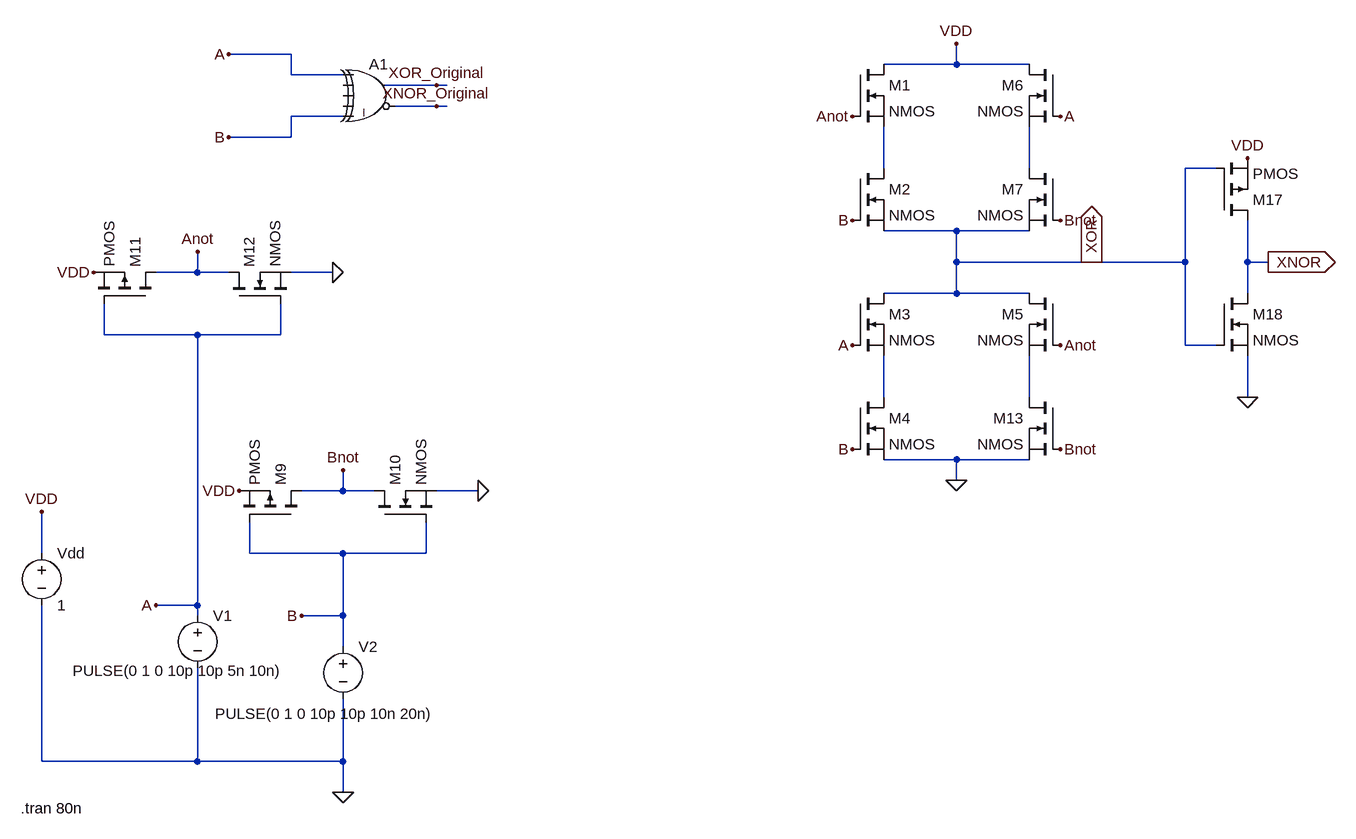
[diagram p0: schematic XOR_&_XNOR_2ip.asc]
XOR_&_XNOR_2ip.asc, the LTspice schematic file:
Version 4
SHEET 1 3108 680
WIRE 528 -656 432 -656
WIRE 1552 -640 1552 -672
WIRE 1552 -640 1440 -640
WIRE 1664 -640 1552 -640
WIRE 528 -624 528 -656
WIRE 608 -624 528 -624
WIRE 752 -608 672 -608
WIRE 768 -608 752 -608
WIRE 752 -576 688 -576
WIRE 768 -576 752 -576
WIRE 608 -560 528 -560
WIRE 528 -528 528 -560
WIRE 528 -528 432 -528
WIRE 1440 -480 1440 -544
WIRE 1664 -480 1664 -544
WIRE 1952 -480 1904 -480
WIRE 1552 -384 1440 -384
WIRE 1664 -384 1552 -384
WIRE 1552 -336 1552 -384
WIRE 1760 -336 1552 -336
WIRE 1904 -336 1904 -480
WIRE 1904 -336 1760 -336
WIRE 2000 -336 2000 -400
WIRE 2032 -336 2000 -336
WIRE 384 -320 384 -352
WIRE 384 -320 320 -320
WIRE 432 -320 384 -320
WIRE 592 -320 528 -320
WIRE 1552 -288 1552 -336
WIRE 1552 -288 1440 -288
WIRE 1664 -288 1552 -288
WIRE 2000 -288 2000 -336
WIRE 240 -224 240 -272
WIRE 384 -224 240 -224
WIRE 512 -224 512 -272
WIRE 512 -224 384 -224
WIRE 1904 -208 1904 -336
WIRE 1952 -208 1904 -208
WIRE 1440 -128 1440 -192
WIRE 1664 -128 1664 -192
WIRE 2000 -128 2000 -192
WIRE 1552 -32 1440 -32
WIRE 1664 -32 1552 -32
WIRE 1552 0 1552 -32
WIRE 608 16 608 -16
WIRE 608 16 544 16
WIRE 656 16 608 16
WIRE 816 16 752 16
WIRE 144 112 144 48
WIRE 464 112 464 64
WIRE 608 112 464 112
WIRE 736 112 736 64
WIRE 736 112 608 112
WIRE 384 192 384 -224
WIRE 384 192 320 192
WIRE 384 208 384 192
WIRE 608 208 608 112
WIRE 608 208 544 208
WIRE 608 256 608 208
WIRE 144 432 144 192
WIRE 384 432 384 288
WIRE 384 432 144 432
WIRE 608 432 608 336
WIRE 608 432 384 432
WIRE 608 480 608 432
FLAG 608 480 0
FLAG 320 192 A
FLAG 144 48 VDD
FLAG 448 16 VDD
FLAG 816 16 0
FLAG 224 -320 VDD
FLAG 592 -320 0
FLAG 1392 -208 A
FLAG 1392 -48 B
FLAG 1712 -48 Bnot
FLAG 1712 -208 Anot
FLAG 1552 0 0
FLAG 1392 -560 Anot
FLAG 1392 -400 B
FLAG 1712 -400 Bnot
FLAG 1712 -560 A
FLAG 2000 -496 VDD
FLAG 2000 -128 0
FLAG 2032 -336 XNOR
IOPIN 2032 -336 Out
FLAG 752 -608 XOR_Original
FLAG 752 -576 XNOR_Original
FLAG 608 -16 Bnot
FLAG 384 -352 Anot
FLAG 432 -656 A
FLAG 432 -528 B
FLAG 544 208 B
FLAG 1552 -672 VDD
FLAG 1760 -336 XOR
IOPIN 1760 -336 Out
SYMBOL voltage 144 96 R0
WINDOW 123 0 0 Left 0
WINDOW 39 0 0 Left 0
SYMATTR InstName Vdd
SYMATTR Value 1
SYMBOL voltage 384 192 R0
WINDOW 123 0 0 Left 0
WINDOW 39 0 0 Left 0
WINDOW 3 -192 101 Left 2
SYMATTR Value PULSE(0 1 0 10p 10p 5n 10n)
SYMATTR InstName V1
SYMBOL voltage 608 240 R0
WINDOW 123 0 0 Left 0
WINDOW 39 0 0 Left 0
WINDOW 3 -197 119 Left 2
SYMATTR Value PULSE(0 1 0 10p 10p 10n 20n)
SYMATTR InstName V2
SYMBOL nmos 1392 -288 R0
SYMATTR InstName M3
SYMBOL nmos 1392 -128 R0
SYMATTR InstName M4
SYMBOL nmos 1712 -288 M0
SYMATTR InstName M5
SYMBOL pmos 544 64 M270
SYMATTR InstName M9
SYMBOL nmos 656 64 R270
SYMATTR InstName M10
SYMBOL pmos 320 -272 M270
SYMATTR InstName M11
SYMBOL nmos 432 -272 R270
SYMATTR InstName M12
SYMBOL nmos 1712 -128 M0
SYMATTR InstName M13
SYMBOL pmos 1952 -400 M180
SYMATTR InstName M17
SYMBOL nmos 1952 -288 R0
SYMATTR InstName M18
SYMBOL Digital\\xor 656 -656 R0
SYMATTR InstName A1
SYMBOL nmos 1392 -640 R0
SYMATTR InstName M1
SYMBOL nmos 1392 -480 R0
SYMATTR InstName M2
SYMBOL nmos 1712 -640 M0
SYMATTR InstName M6
SYMBOL nmos 1712 -480 M0
SYMATTR InstName M7
TEXT 112 504 Left 2 !.tran 80n

The netlist it stands for:
* XOR_&_XNOR_2ip.asc
Vdd VDD 0 1
V1 A 0 PULSE(0 1 0 10p 10p 5n 10n)
V2 B 0 PULSE(0 1 0 10p 10p 10n 20n)
M3 XOR A N003 N003 NMOS
M4 N003 B 0 0 NMOS
M5 XOR Anot N004 N004 NMOS
M9 Bnot B VDD VDD PMOS
M10 Bnot B 0 0 NMOS
M11 Anot A VDD VDD PMOS
M12 Anot A 0 0 NMOS
M13 N004 Bnot 0 0 NMOS
M17 XNOR XOR VDD VDD PMOS
M18 XNOR XOR 0 0 NMOS
A1 A 0 0 0 B XNOR_Original XOR_Original 0 XOR
M1 VDD Anot N001 N001 NMOS
M2 N001 B XOR XOR NMOS
M6 VDD A N002 N002 NMOS
M7 N002 Bnot XOR XOR NMOS
.model NMOS NMOS
.model PMOS PMOS
.lib standard.mos
.tran 80n
.backanno
.end